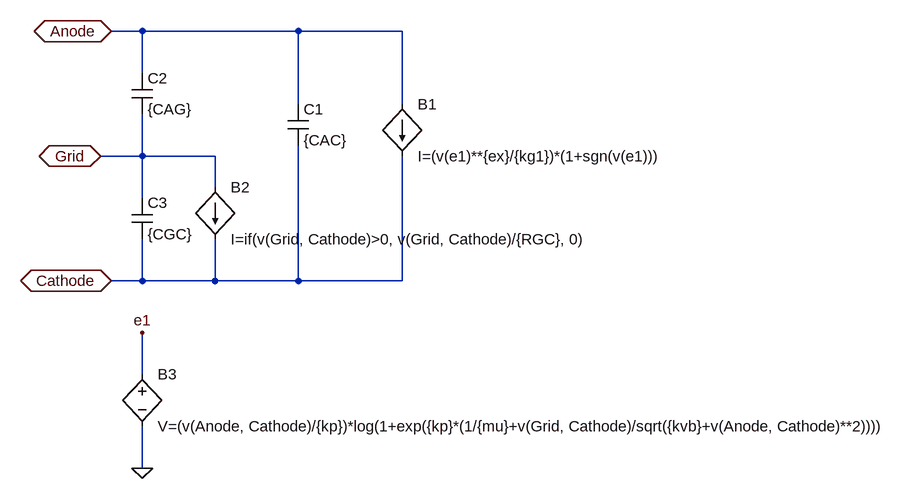
[diagram p0: schematic triode.asc]
triode.asc, the LTspice schematic file:
Version 4
SHEET 1 2796 692
WIRE 96 -16 48 -16
WIRE 336 -16 96 -16
WIRE 496 -16 336 -16
WIRE 96 48 96 -16
WIRE 336 96 336 -16
WIRE 496 96 496 -16
WIRE 96 176 96 112
WIRE 96 176 32 176
WIRE 208 176 96 176
WIRE 208 224 208 176
WIRE 96 240 96 176
WIRE 96 368 96 304
WIRE 96 368 48 368
WIRE 208 368 208 304
WIRE 208 368 96 368
WIRE 336 368 336 160
WIRE 336 368 208 368
WIRE 496 368 496 176
WIRE 496 368 336 368
WIRE 96 512 96 448
WIRE 96 656 96 592
FLAG 48 -16 Anode
IOPIN 48 -16 BiDir
FLAG 32 176 Grid
IOPIN 32 176 BiDir
FLAG 48 368 Cathode
IOPIN 48 368 BiDir
FLAG 96 448 e1
FLAG 96 656 0
SYMBOL bi 496 96 R0
SYMATTR InstName B1
SYMATTR Value I=(v(e1)**{ex}/{kg1})*(1+sgn(v(e1)))
SYMBOL bi 208 224 R0
SYMATTR InstName B2
SYMATTR Value I=if(v(Grid, Cathode)>0, v(Grid, Cathode)/{RGC}, 0)
SYMBOL cap 320 96 R0
SYMATTR InstName C1
SYMATTR Value {CAC}
SYMBOL cap 80 48 R0
SYMATTR InstName C2
SYMATTR Value {CAG}
SYMBOL cap 80 240 R0
SYMATTR InstName C3
SYMATTR Value {CGC}
SYMBOL bv 96 496 R0
SYMATTR InstName B3
SYMATTR Value V=(v(Anode, Cathode)/{kp})*log(1+exp({kp}*(1/{mu}+v(Grid, Cathode)/sqrt({kvb}+v(Anode, Cathode)**2))))

The netlist it stands for:
* triode.asc
B1 Anode Cathode I=(v(e1)**{ex}/{kg1})*(1+sgn(v(e1)))
B2 Grid Cathode I=if(v(Grid, Cathode)>0, v(Grid, Cathode)/{RGC}, 0)
C1 Anode Cathode {CAC}
C2 Anode Grid {CAG}
C3 Grid Cathode {CGC}
B3 e1 0 V=(v(Anode, Cathode)/{kp})*log(1+exp({kp}*(1/{mu}+v(Grid, Cathode)/sqrt({kvb}+v(Anode, Cathode)**2))))
.backanno
.end